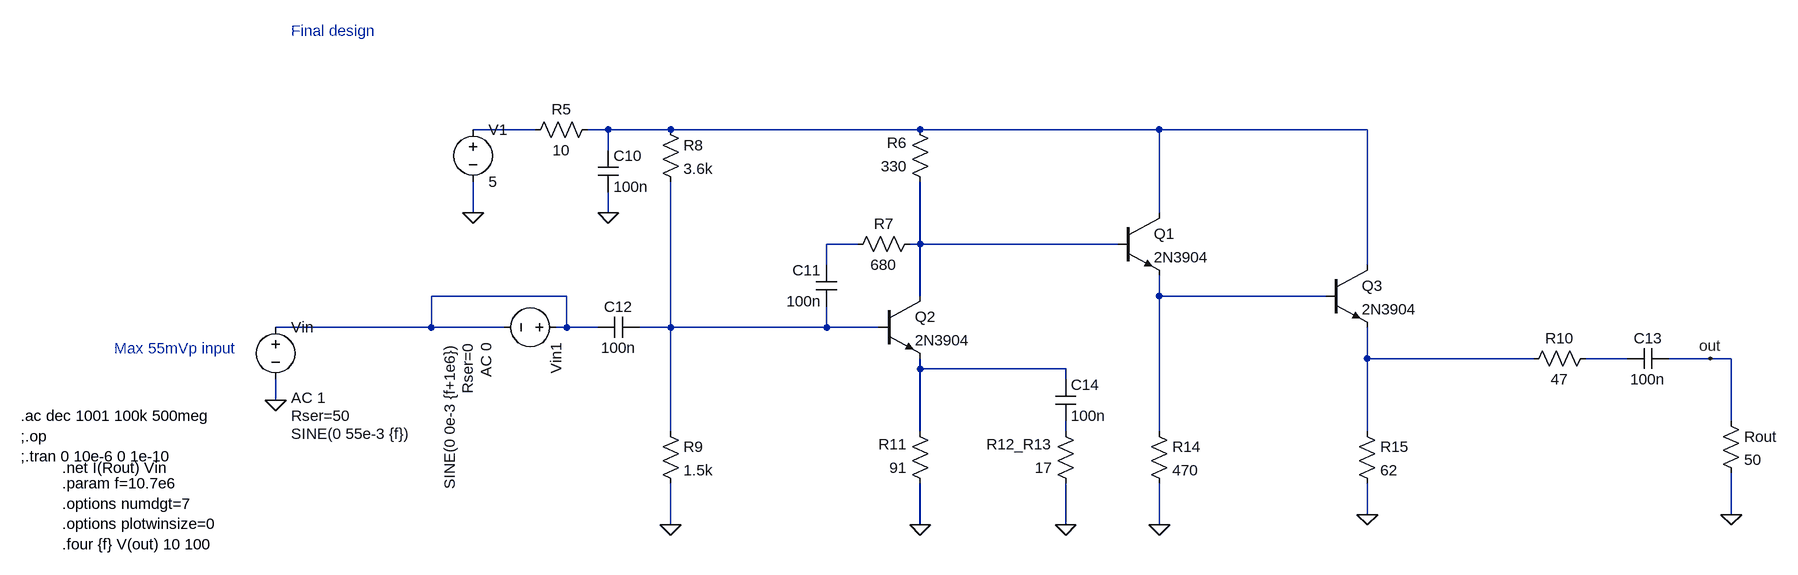
[diagram p0: schematic TIA3_5V.asc]
TIA3_5V.asc, the LTspice schematic file:
Version 4
SHEET 1 1840 680
WIRE -352 -112 -448 -112
WIRE -240 -112 -272 -112
WIRE -144 -112 -240 -112
WIRE 240 -112 -144 -112
WIRE 608 -112 240 -112
WIRE 928 -112 608 -112
WIRE -240 -80 -240 -112
WIRE -448 16 -448 -32
WIRE -240 16 -240 -16
WIRE 608 16 608 -112
WIRE 144 64 96 64
WIRE 240 64 240 -32
WIRE 240 64 224 64
WIRE 544 64 240 64
WIRE 96 96 96 64
WIRE 928 96 928 -112
WIRE -304 144 -512 144
WIRE 240 144 240 64
WIRE 608 144 608 112
WIRE 864 144 608 144
WIRE -512 192 -512 144
WIRE -512 192 -752 192
WIRE -400 192 -512 192
WIRE -304 192 -304 144
WIRE -304 192 -320 192
WIRE -256 192 -304 192
WIRE -144 192 -144 -32
WIRE -144 192 -192 192
WIRE 96 192 96 160
WIRE 96 192 -144 192
WIRE 176 192 96 192
WIRE 928 240 928 192
WIRE 1184 240 928 240
WIRE 1328 240 1264 240
WIRE 1456 240 1392 240
WIRE 1488 240 1456 240
WIRE 240 256 240 240
WIRE 464 256 240 256
WIRE 464 272 464 256
WIRE -752 304 -752 272
WIRE 1488 336 1488 240
WIRE -144 352 -144 192
WIRE 240 352 240 256
WIRE 464 352 464 336
WIRE 608 352 608 144
WIRE 928 352 928 240
WIRE 928 480 928 432
WIRE 1488 480 1488 416
WIRE -144 496 -144 432
WIRE 240 496 240 432
WIRE 464 496 464 432
WIRE 608 496 608 432
FLAG -144 496 0
FLAG 240 496 0
FLAG 464 496 0
FLAG 608 496 0
FLAG 928 480 0
FLAG 1488 480 0
FLAG -448 16 0
FLAG -752 304 0
FLAG -240 16 0
FLAG 1456 240 out
DATAFLAG 384 -112 ""
DATAFLAG 384 64 ""
DATAFLAG -64 192 ""
DATAFLAG 400 256 ""
DATAFLAG 720 144 ""
DATAFLAG 1056 240 ""
SYMBOL npn 176 144 R0
SYMATTR InstName Q2
SYMATTR Value 2N3904
SYMBOL res -160 -128 R0
SYMATTR InstName R8
SYMATTR Value 3.6k
SYMBOL res -160 336 R0
SYMATTR InstName R9
SYMATTR Value 1.5k
SYMBOL res 240 48 R90
WINDOW 0 0 56 VBottom 2
WINDOW 3 32 56 VTop 2
SYMATTR InstName R7
SYMATTR Value 680
SYMBOL res 256 -16 R180
WINDOW 0 36 76 Left 2
WINDOW 3 36 40 Left 2
SYMATTR InstName R6
SYMATTR Value 330
SYMBOL res 256 448 R180
WINDOW 0 36 76 Left 2
WINDOW 3 36 40 Left 2
SYMATTR InstName R11
SYMATTR Value 91
SYMBOL res 480 448 R180
WINDOW 0 36 76 Left 2
WINDOW 3 36 40 Left 2
SYMATTR InstName R12_R13
SYMATTR Value 17
SYMBOL npn 544 16 R0
SYMATTR InstName Q1
SYMATTR Value 2N3904
SYMBOL npn 864 96 R0
SYMATTR InstName Q3
SYMATTR Value 2N3904
SYMBOL res 592 336 R0
SYMATTR InstName R14
SYMATTR Value 470
SYMBOL res 912 336 R0
SYMATTR InstName R15
SYMATTR Value 62
SYMBOL res 1280 224 R90
WINDOW 0 0 56 VBottom 2
WINDOW 3 32 56 VTop 2
SYMATTR InstName R10
SYMATTR Value 47
SYMBOL cap 1392 224 R90
WINDOW 0 0 32 VBottom 2
WINDOW 3 32 32 VTop 2
SYMATTR InstName C13
SYMATTR Value 100n
SYMBOL cap 112 160 R180
WINDOW 0 24 56 Left 2
WINDOW 3 24 8 Left 2
SYMATTR InstName C11
SYMATTR Value 100n
SYMBOL cap -256 208 R270
WINDOW 0 32 32 VTop 2
WINDOW 3 0 32 VBottom 2
SYMATTR InstName C12
SYMATTR Value 100n
SYMBOL res 1472 320 R0
SYMATTR InstName Rout
SYMATTR Value 50
SYMBOL voltage -448 -128 R0
WINDOW 123 0 0 Left 0
WINDOW 39 0 0 Left 0
SYMATTR InstName V1
SYMATTR Value 5
SYMBOL voltage -752 176 R0
WINDOW 3 24 180 Left 2
WINDOW 123 24 124 Left 2
WINDOW 39 24 152 Left 2
SYMATTR Value SINE(0 55e-3 {f})
SYMATTR Value2 AC 1
SYMATTR SpiceLine Rser=50
SYMATTR InstName Vin
SYMBOL cap 448 272 R0
SYMATTR InstName C14
SYMATTR Value 100n
SYMBOL res -256 -128 R90
WINDOW 0 0 56 VBottom 2
WINDOW 3 32 56 VTop 2
SYMATTR InstName R5
SYMATTR Value 10
SYMBOL cap -256 -80 R0
SYMATTR InstName C10
SYMATTR Value 100n
SYMBOL voltage -304 192 R90
WINDOW 3 24 180 Left 2
WINDOW 123 24 124 Left 2
WINDOW 39 24 152 Left 2
SYMATTR Value SINE(0 0e-3 {f+1e6})
SYMATTR Value2 AC 0
SYMATTR SpiceLine Rser=0
SYMATTR InstName Vin1
TEXT -1080 408 Left 2 !.net I(Rout) Vin
TEXT -1144 328 Left 2 !.ac dec 1001 100k 500meg\n;.op\n;.tran 0 10e-6 0 1e-10
TEXT -1080 432 Left 2 !.param f=10.7e6\n.options numdgt=7\n.options plotwinsize=0\n.four {f} V(out) 10 100
TEXT -1000 224 Left 2 ;Max 55mVp input
TEXT -728 -264 Left 2 ;Final design

The netlist it stands for:
* TIA3_5V.asc
Q2 N004 N007 N010 0 2N3904
R8 N002 N007 3.6k
R9 N007 0 1.5k
R7 N004 N003 680
R6 N004 N002 330
R11 0 N010 91
R12_R13 0 N011 17
Q1 N002 N004 N006 0 2N3904
Q3 N002 N006 N008 0 2N3904
R14 N006 0 470
R15 N008 0 62
R10 N009 N008 47
C13 out N009 100n
C11 N007 N003 100n
C12 N005 N007 100n
Rout out 0 50
V1 N001 0 5
Vin N005 0 SINE(0 55e-3 {f}) AC 1 Rser=50
C14 N010 N011 100n
R5 N002 N001 10
C10 N002 0 100n
Vin1 N005 N005 SINE(0 0e-3 {f+1e6}) AC 0 Rser=0
.model NPN NPN
.model PNP PNP
.lib standard.bjt
.net I(Rout) Vin
.ac dec 1001 100k 500meg
;.op
;.tran 0 10e-6 0 1e-10
.param f=10.7e6
.options numdgt=7
.options plotwinsize=0
.four {f} V(out) 10 100
* Max 55mVp input
* Final design
.backanno
.end